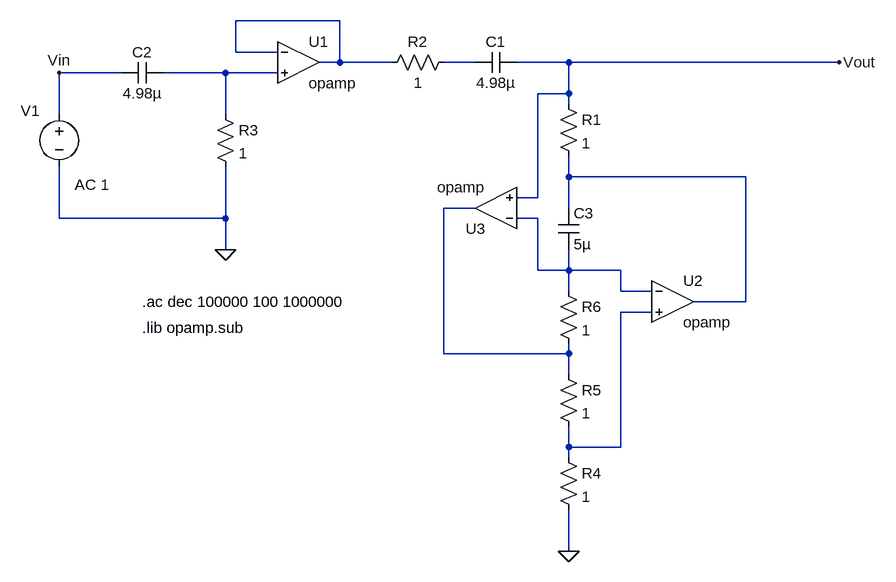
[diagram p0: schematic circuito_desnorm.asc]
circuito_desnorm.asc, the LTspice schematic file:
Version 4
SHEET 1 932 964
WIRE 32 128 -128 128
WIRE -128 176 -128 128
WIRE -64 176 -128 176
WIRE 32 192 32 128
WIRE 32 192 0 192
WIRE 112 192 32 192
WIRE 240 192 192 192
WIRE 384 192 304 192
WIRE 800 192 384 192
WIRE -304 208 -400 208
WIRE -144 208 -240 208
WIRE -64 208 -144 208
WIRE 384 240 384 192
WIRE 384 240 336 240
WIRE 384 256 384 240
WIRE -400 272 -400 208
WIRE -144 272 -144 208
WIRE 384 368 384 336
WIRE 656 368 384 368
WIRE 336 400 336 240
WIRE 336 400 304 400
WIRE 240 416 192 416
WIRE 384 416 384 368
WIRE -400 432 -400 352
WIRE -144 432 -144 352
WIRE -144 432 -400 432
WIRE 336 432 304 432
WIRE -144 480 -144 432
WIRE 336 512 336 432
WIRE 384 512 384 480
WIRE 384 512 336 512
WIRE 464 512 384 512
WIRE 384 544 384 512
WIRE 464 544 464 512
WIRE 512 544 464 544
WIRE 656 560 656 368
WIRE 656 560 576 560
WIRE 512 576 464 576
WIRE 192 640 192 416
WIRE 384 640 384 624
WIRE 384 640 192 640
WIRE 384 672 384 640
WIRE 384 784 384 752
WIRE 464 784 464 576
WIRE 464 784 384 784
WIRE 384 800 384 784
WIRE 384 944 384 880
FLAG -400 208 Vin
FLAG 800 192 Vout
FLAG -144 480 0
FLAG 384 944 0
SYMBOL voltage -400 256 R0
WINDOW 123 24 124 Left 2
WINDOW 39 0 0 Left 0
WINDOW 0 -59 10 Left 2
SYMATTR Value2 AC 1
SYMATTR InstName V1
SYMATTR Value ""
SYMBOL OpAmps\\opamp -32 128 R0
SYMATTR InstName U1
SYMBOL res 368 656 R0
SYMATTR InstName R5
SYMATTR Value 1
SYMBOL OpAmps\\opamp 544 496 R0
SYMATTR InstName U2
SYMBOL OpAmps\\opamp 272 480 R180
SYMATTR InstName U3
SYMBOL res 368 784 R0
SYMATTR InstName R4
SYMATTR Value 1
SYMBOL res 208 176 R90
WINDOW 0 0 56 VBottom 2
WINDOW 3 32 56 VTop 2
SYMATTR InstName R2
SYMATTR Value 1
SYMBOL cap 304 176 R90
WINDOW 0 0 32 VBottom 2
WINDOW 3 32 32 VTop 2
SYMATTR InstName C1
SYMATTR Value 4.98µ
SYMBOL res -160 256 R0
SYMATTR InstName R3
SYMATTR Value 1
SYMBOL cap -240 192 R90
WINDOW 0 0 32 VBottom 2
WINDOW 3 32 32 VTop 2
SYMATTR InstName C2
SYMATTR Value 4.98µ
SYMBOL res 368 528 R0
SYMATTR InstName R6
SYMATTR Value 1
SYMBOL res 368 240 R0
SYMATTR InstName R1
SYMATTR Value 1
SYMBOL cap 368 416 R0
SYMATTR InstName C3
SYMATTR Value 5µ
TEXT -272 600 Left 2 !.lib opamp.sub
TEXT -272 560 Left 2 !.ac dec 100000 100 1000000

The netlist it stands for:
* circuito_desnorm.asc
V1 Vin 0 AC 1
XU1 N001 N003 N001 opamp Aol=100K GBW=10Meg  ; pins invin noninvin out
R5 N005 N007 1
XU2 N006 N007 N004 opamp Aol=100K GBW=10Meg  ; pins invin noninvin out
XU3 N006 Vout N005 opamp Aol=100K GBW=10Meg  ; pins invin noninvin out
R4 N007 0 1
R2 N002 N001 1
C1 Vout N002 4.98µ
R3 N003 0 1
C2 N003 Vin 4.98µ
R6 N006 N005 1
R1 Vout N004 1
C3 N004 N006 5µ
.lib opamp.sub
.ac dec 100000 100 1000000
.backanno
.end